# Altium schematic sheet Fuse1.SchDoc
size A4
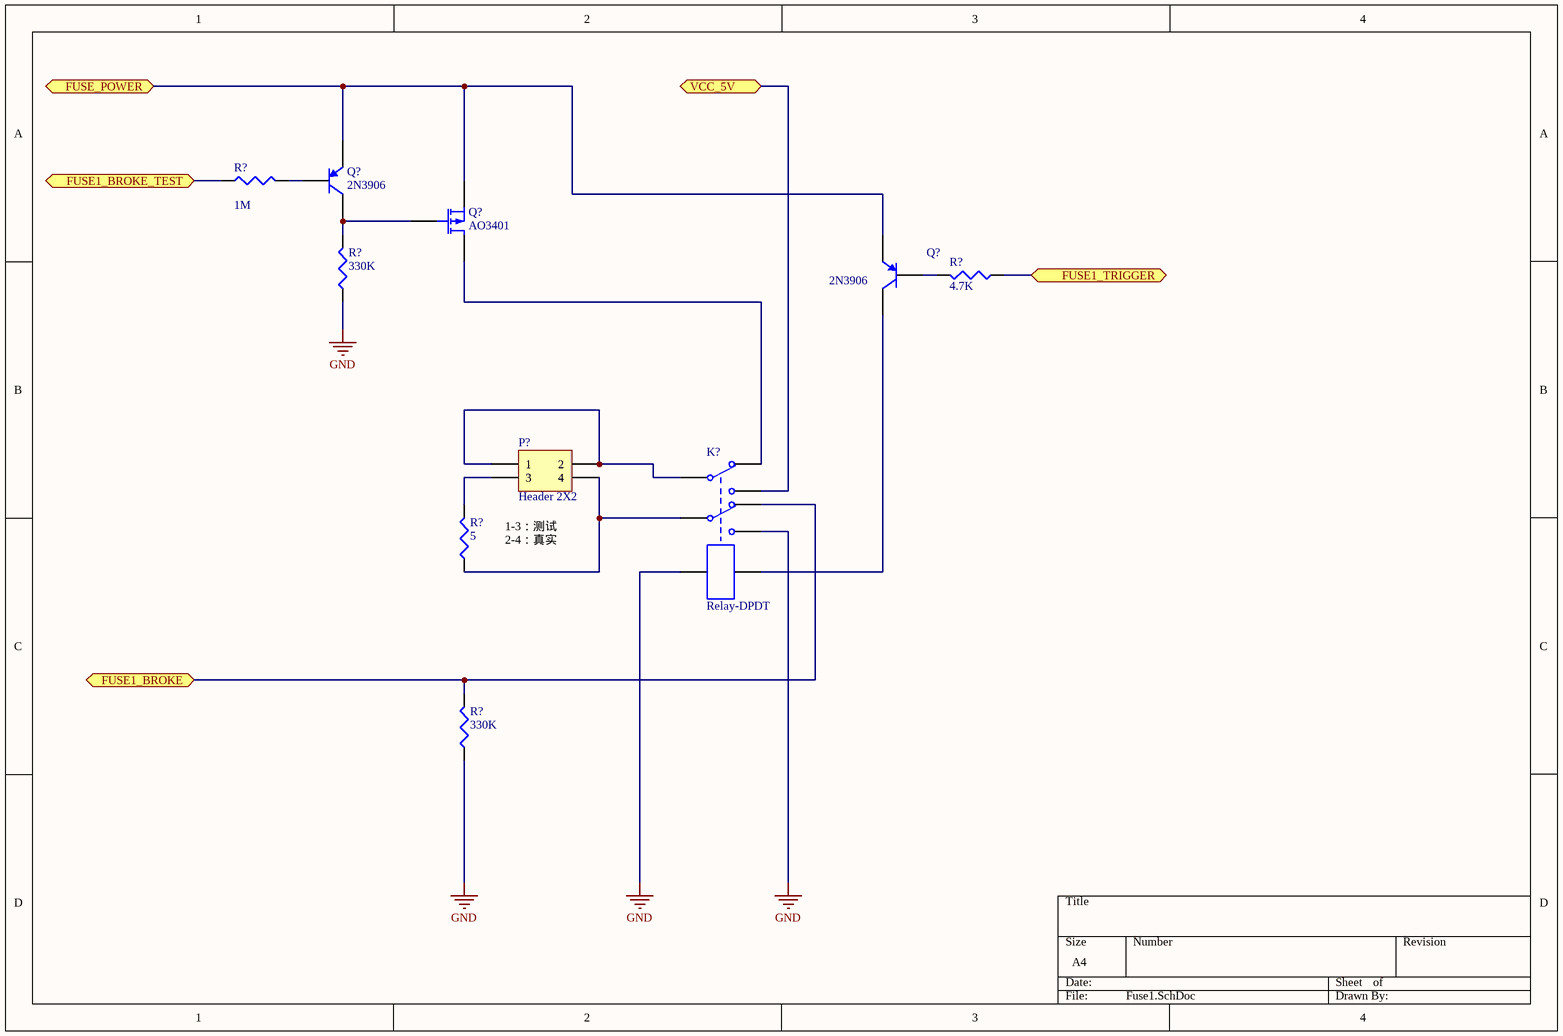
[diagram p0: Fuse1.SchDoc]

## Parts
(Parts that share a designator on the sheet are numbered #1, #2 ... from top to bottom, then left to right.)
K?  Relay-DPDT  [DIP-P8]
P?  Header 2X2  [HDR2X2]
Q?#1  2N3906  [SOT-23B_N]
Q?#2  AO3401  [E3]
Q?#3  2N3906  [SOT-23B_N]
R?#1  value 1M  [12Z-2010]  (hidden comment: Res3)
R?#2  value 330K  [12Z-2010]  (hidden comment: Res3)
R?#3  value 4.7K  [12Z-2010]  (hidden comment: Res3)
R?#4  value 5  [12Z-2010]  (hidden comment: Res3)
R?#5  value 330K  [12Z-2010]  (hidden comment: Res3)

## Ports
FUSE1_BROKE (bidir), FUSE1_BROKE_TEST (bidir), FUSE1_TRIGGER (bidir), FUSE_POWER (bidir), VCC_5V (bidir)

## Nets
GND: K?.6 K?.7 R?#2.1 R?#5.1
FUSE1_BROKE: K?.5 R?#5.2 ; port FUSE1_BROKE
FUSE1_BROKE_TEST: R?#1.1 ; port FUSE1_BROKE_TEST
FUSE1_TRIGGER: R?#3.1 ; port FUSE1_TRIGGER
FUSE_POWER: Q?#1.3(E) Q?#2.3(S) Q?#3.3(E) ; port FUSE_POWER
VCC_5V: K?.3 ; port VCC_5V
NetK?_1: K?.1 P?.1 P?.2
NetK?_2: K?.2 Q?#2.1(D)
NetK?_4: K?.4 P?.4 R?#4.1
NetK?_8: K?.8 Q?#3.1(C)
NetP?_3: P?.3 R?#4.2
NetQ?#1_1: Q?#1.1(C) Q?#2.2(G) R?#2.2
NetQ?#1_2: Q?#1.2(B) R?#1.2
NetQ?#3_2: Q?#3.2(B) R?#3.2

## Notes on the sheet
- 1-3：测试
  2-4：真实

## Library data of the parts
K? = Relay-DPDT: Dual-Pole Dual-Throw Relay; Published: 24-Mar-1999; LatestRevisionDate: 17-Jul-2002; LatestRevisionNote: Re-released for DXP Platform.; PackageReference: DIP-P8; Publisher: Altium Limited; PackageDescription: Relay; 8 Leads
P? = Header 2X2: Header, 2-Pin, Dual row; LatestRevisionDate: 17-Jul-2002; LatestRevisionNote: Re-released for DXP Platform.; Publisher: Altium Limited
Q?#1 Q?#3 = PNP: PNP Bipolar Transistor; Published: 8-Jun-2000; LatestRevisionDate: 29-May-2009; LatestRevisionNote: IPC-7351 Footprint Added.; PackageVersion: Aug-1999; PackageReference: SOT-23B; Publisher: Altium Limited; PackageDescription: 3-Pin SOT-23 Package 0.95 mm Pitch, 2.4 mm Lead Span
Q?#2 = MOSFET-P: P-Channel MOSFET; Published: 8-Jun-2000; LatestRevisionDate: 17-Jul-2002; LatestRevisionNote: Re-released for DXP Platform.; PackageVersion: 1995/1996; PackageReference: E3; Publisher: Altium Limited; PackageDescription: TO, Flat Index; 3 In-Line, Axial Leads; Body Dia. 4.6mm; Lead Dia. 0.5 mm (max)
R?#1-R?#5 = Res3: Resistor; Published: 8-Jun-2000; LatestRevisionDate: 29-May-2009; LatestRevisionNote: IPC-7351 Footprint Added.; PackageReference: J1-0603; Publisher: Altium Limited; PackageDescription: Chip Resistor